# Altium schematic sheet 02_Connectors.SchDoc: Off Board Connectors
size A; Revision: A; SheetNumber: 2; SheetTotal: 4; ECE315_Project_Name: ECE453 F23 Base Project
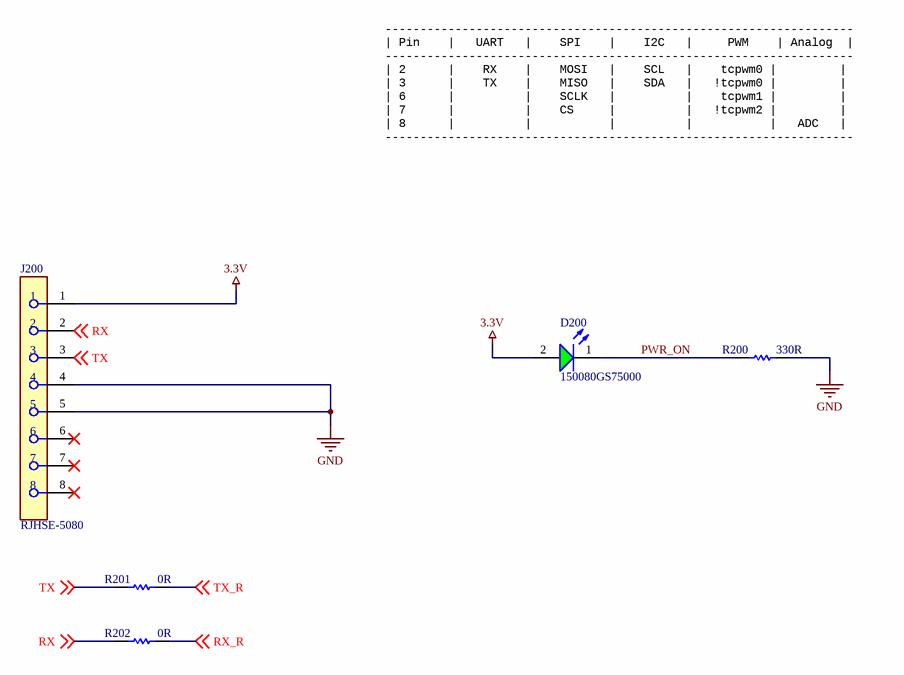
[diagram p0: 02_Connectors.SchDoc]

## Parts
D200  150080GS75000  [WL-SMCW_0805_150080xx75000]
J200  RJHSE-5080  [FP-RJHSE-5080-MFG]
R200  330R  [RESC2013X60X40LL20T25]
R201  0R  [RESC2013X70X40NL20T20]
R202  0R  [RESC2013X70X40NL20T20]

## Nets
3.3V: D200.2(A) J200.1
GND: J200.4 J200.5 R200.2
PWR_ON: D200.1(K) R200.1
RX: J200.2 R202.1 ; off-sheet RX
RX_R: R202.2 ; off-sheet RX_R
TX: J200.3 R201.1 ; off-sheet TX
TX_R: R201.2 ; off-sheet TX_R

Not connected (* = marked no-connect by the designer): J200 6* 7* 8*

## Notes on the sheet
- -------------------------------------------------------------------
  | Pin    |   UART   |    SPI    |    I2C   |     PWM    | Analog  |
  -------------------------------------------------------------------
  | 2      |    RX    |    MOSI   |    SCL   |    tcpwm0 |         |
  | 3      |    TX    |    MISO   |    SDA   |   !tcpwm0 |         |
  | 6      |          |    SCLK   |          |    tcpwm1 |         |
  | 7      |          |    CS     |          |   !tcpwm2 |         |
  | 8      |          |           |          |           |   ADC   |
  -------------------------------------------------------------------
- Title:
- Size:
- A
- Project
- Rev:
- Sheet:
- of
- College of Engineering
- 1415 Engineering Drive
- Madison, WI 53706

## Library data of the parts
D200 = CMP-1426-00007-2: NexarPartId: 29717780; Manufacturer: Wurth Electronics; Wavelength: 520nm; Forward Current: 100mA; Lens Style: Clear, Rectangular; Dominant Wavelength: 525nm; Max Junction Temperature (Tj): 95°C; Power Dissipation: 105mW; Luminous Intensity: 450mcd; Peak Wavelength: 515nm; Color: Green; Viewing Angle: 140°; Test Current: 20mA; Reverse Voltage: 5V; Forward Voltage: 3.2V; Lens Color: Colorless; Lens Transparency: Clear; Lens Size: 1.25mm; Mount: Surface Mount; REACH SVHC: Unknown; Min Operating Temperature: -40°C; Case Code (Imperial): 0805; Case/Package: 0805; Max Operating Temperature: 85°C; RoHS: Compliant; Length: 2mm; Height: 700µm; Width: 1.25mm; Case Code (Metric): 2012; Packaging: Tape and Reel; Max Reverse Voltage (DC): 5V; Supplier: Digikey; Supplier Part Number: 732-4983-1-ND; Manufacturer Part Number: 150080GS75000; Category: LEDs; Stock: 29733; Pricing: 1=0.19, 50=0.176, 100=0.151, 500=0.131 (USD); Mounting Technology: Surface Mount; Package Quantity: 1; Series: WL-SMCW; RoHS Compliant: Yes; Reach SVHC Compliant: Unknown; ComponentLink1URL: https://datasheet.ciiva.com/29563/150080gs75000-29563008.pdf?src-supplier=Digikey; ComponentLink1Description: https://datasheet.ciiva.com/29563/150080gs75000-29563008.pdf?src-supplier=Digikey; ComponentLink2URL: https://datasheet.ciiva.com/29279/759434-da-01-en-chipled-0805-w-kl-gruen-150080gs75000-29279039.pdf?src-supplier=Conrad; ComponentLink2Description: https://datasheet.ciiva.com/29279/759434-da-01-en-chipled-0805-w-kl-gruen-150080gs75000-29279039.pdf?src-supplier=Conrad
J200 = CMP-02366-000003-1: CONN MOD JACK 8P8C R/A UNSHLD; Manufacturer: Amphenol; Current Rating: 1.5A; Voltage Rating: 125V; Pitch: 1.02mm; Conn Orientation: Right Angle; Number Of Contacts: 8; Is Female: yes; Conn Gender: Female; Contact Resistance: 20mR; Number of Ports: 1; Connector Type: RJ45; Lead Free: Yes; Device Class L3: unset; Footprint Url: https://cdn.amphenol-icc.com/media/wysiwyg/files/drawing/rjhse5080.pdf?__cf_chl_jschl_tk__=e349db0bbbb6188a39347cd5e541b92fa02c9719-1587748343-0-AW7tChdeHzRPLX9gSWj7WrKaXQoY9BsmT9Ek0h-T62M9y3Rs9iypFcOtkzb-6sGYQEjFE-jcoNciDETCOZrh1rYyOesac5SvYLoLwHIsHvF4AKBlx-MXmfZUVk9OTTJLqyQq2qMm0PFRLJpNcK0nrKResqOniRSYixG2sPTmOPraH-ULJFBDL602CHqcI9KKBgTq90Jh1OL2Td4moJ99rFsJRJ1Tk_uoxGe8ublcP_ARu-uLpWcQrBcwOcHDTAwL29DAwVaqcH7ta8Ks7WMlHmVl_pILeEDwT0bE9vu5Pa5S3PtNRF1leuFkgi_FMbUxTDulc5xzbXSfng8srUIV1lWXny5nx1fZJEUa_w97yKjffzBMxiWLWVN-V7-uqAaPbyv_m-wRyw5O25OZNyJOeGU; ComponentLink2URL: https://cdn.amphenol-icc.com/media/wysiwyg/files/documentation/datasheet/inputoutput/io-modjack-rjhse.pdf; Device Class L1: Connectors; Package: CONN_MOD_JACK; Mouser Description: Modular Connectors / Ethernet Connectors R/A RJ45 NONSHIELDED 8 CONT NO LEDS; Manufacturer Part Number: RJHSE-5080; Octopart: https://octopart.com/rjhse-5080-amphenol-45060; Category: Conn; Height: 0.535inch; Temperature: -55°C to +85°C; Digikey Description: CONN MOD JACK 8P8C R/A UNSHLD; Device Class L2: Modular / Ethernet Connectors; Contact Material: Gold,Nickel; ComponentLink2Description: Datasheet; Temperature Range Low: -55°C; RoHS: TRUE; Automotive: No; Temperature Range High: +85°C; Supplier: Digikey; Supplier Part Number: RJHSE-5080-ND; Stock: 72112; Pricing: 1=1.03, 10=0.867, 25=0.832, 50=0.8142, 100=0.7788, 250=0.708, 500=0.6372, 1000=0.56641, 2500=0.51331 (USD); Mounting Technology: Through Hole,Panel; Contact Plating: Gold; Max Current Rating: 1.5A; Number of Positions Loaded: 8; Max Voltage Rating (AC): 125V; Orientation: Right Angle; Packaging: Rail/Tube; Gender: Female; Termination: Solder; Number of Positions: 8; Voltage Rating (DC): 125V; Length: 15.75mm; Depth: 14.99mm; Radiation Hardening: No; RoHS Compliant: Yes; Reach SVHC Compliant: Unknown; ComponentLink1URL: https://datasheet.ciiva.com/7629/1682821-7629402.pdf?src-supplier=Element14; ComponentLink1Description: https://datasheet.ciiva.com/7629/1682821-7629402.pdf?src-supplier=Element14; ComponentLink3URL: https://datasheet.ciiva.com/1432/1693748-1432448.pdf?src-supplier=Element14; ComponentLink3Description: https://datasheet.ciiva.com/1432/1693748-1432448.pdf?src-supplier=Element14
R200 = CMP-2001-00628-1: Manufacturer: Panasonic; Part Number: ERA6AEB331V; Manufacturer Part Number: ERA-6AEB331V; Tolerance: 0.1%; Power: 125mW; Rated Temperature: 85°C; Temperature Coefficient: 25ppm/°C; Working Voltage: 100V; Package Height: 0.5mm; Package Length: 2mm; Package Width: 1.25mm; Reference Standard: AEC-Q200; Supplier: Digikey; Supplier Part Number: P330DACT-ND; RoHS: Yes; Category: Chip SMD Resistors; Stock: 18932; Pricing: 1=0.13, 10=0.095, 50=0.0748, 100=0.067, 500=0.05106, 1000=0.04511 (USD); Mounting Technology: Surface Mount; Pins: 2; Case/Package: 0805; Terminal Finish: Nickel; Min Operating Temperature: -55°C; Max Operating Temperature: 155°C; JESD-609 Code: e3; Resistor Type: FIXED RESISTOR; Construction: Rectangular; Package Style: SMTMeter; Packaging: Tape and Reel; Value: 330R; Technology: THIN FILM; Termination: Wraparound; Reach SVHC Compliant: Yes; RoHS Compliant: Yes; ComponentLink1URL: https://datasheet.ciiva.com:443/pdfs/VipMasterIC/IC/PANA/PANA-S-A0009459258/PANA-S-A0009459258-1.pdf?src-supplier=IHS+Markit; ComponentLink1Description: https://datasheet.ciiva.com:443/pdfs/VipMasterIC/IC/PANA/PANA-S-A0009459258/PANA-S-A0009459258-1.pdf?src-supplier=IHS+Markit; ComponentLink2URL: https://datasheet.ciiva.com/11808/0900766b80eb1d8c-11808093.pdf?src-supplier=Rs; ComponentLink2Description: https://datasheet.ciiva.com/11808/0900766b80eb1d8c-11808093.pdf?src-supplier=Rs; ComponentLink3URL: https://datasheet.ciiva.com/29184/452857-da-01-en-widerstand-0805-era-29184079.pdf?src-supplier=Conrad; ComponentLink3Description: https://datasheet.ciiva.com/29184/452857-da-01-en-widerstand-0805-era-29184079.pdf?src-supplier=Conrad; ComponentLink4URL: https://datasheet.ciiva.com/30237/54aoa0000ce26-30237450.pdf?src-supplier=Onlinecomponents.com; ComponentLink4Description: https://datasheet.ciiva.com/30237/54aoa0000ce26-30237450.pdf?src-supplier=Onlinecomponents.com; ComponentLink5URL: https://datasheet.ciiva.com/16777/70068849-16777611.pdf?src-supplier=Allied+Electronics; ComponentLink5Description: https://datasheet.ciiva.com/16777/70068849-16777611.pdf?src-supplier=Allied+Electronics; ComponentLink6URL: https://datasheet.ciiva.com/9182/aoa0000ce26-9182968.pdf?src-supplier=Avnet; ComponentLink6Description: https://datasheet.ciiva.com/9182/aoa0000ce26-9182968.pdf?src-supplier=Avnet; ComponentLink7URL: https://datasheet.ciiva.com/48536/era-eng-tds-48536857.pdf?src-supplier=Distrelec; ComponentLink7Description: https://datasheet.ciiva.com/48536/era-eng-tds-48536857.pdf?src-supplier=Distrelec; ComponentLink8URL: https://datasheet.ciiva.com/22744/1776116-22744153.pdf?src-supplier=Element14; ComponentLink8Description: https://datasheet.ciiva.com/22744/1776116-22744153.pdf?src-supplier=Element14; ComponentLink9URL: https://datasheet.ciiva.com/46436/485442-46436606.pdf?src-supplier=Element14; ComponentLink9Description: https://datasheet.ciiva.com/46436/485442-46436606.pdf?src-supplier=Element14; ComponentLink10URL: https://datasheet.ciiva.com/6138/485442-6138585.pdf?src-supplier=Farnell; ComponentLink10Description: https://datasheet.ciiva.com/6138/485442-6138585.pdf?src-supplier=Farnell; ComponentLink11URL: https://datasheet.ciiva.com/6138/485442-6138589.pdf?src-supplier=Farnell; ComponentLink11Description: https://datasheet.ciiva.com/6138/485442-6138589.pdf?src-supplier=Farnell; ComponentLink12URL: https://datasheet.ciiva.com/22759/485442-22759176.pdf?src-supplier=Farnell; ComponentLink12Description: https://datasheet.ciiva.com/22759/485442-22759176.pdf?src-supplier=Farnell; ComponentLink13URL: https://datasheet.ciiva.com/43457/485442-43457816.pdf?src-supplier=Farnell; ComponentLink13Description: https://datasheet.ciiva.com/43457/485442-43457816.pdf?src-supplier=Farnell; ComponentLink14URL: https://datasheet.ciiva.com/24164/aoa0000ce26-197354-24164407.pdf?src-supplier=Mouser; ComponentLink14Description: https://datasheet.ciiva.com/24164/aoa0000ce26-197354-24164407.pdf?src-supplier=Mouser
R201 R202 = CMP-1665-00002-5: Chip Resistor, 0 Ohm, +/- 1%, 0.125 W, -55 to 155 degC, 0805 (2012 Metric), RoHS, Tape and Reel; PartNumber: ERJ-6GEY0R00V; Manufacturer: Panasonic; Tolerance: 5%; Resistance: 0 Ohm; Power: 125mW; Rated Temperature: 70°C; Package Height: 0.6mm; Package Length: 2mm; Package Width: 1.25mm; Reference Standard: AEC-Q200; REACH SVHC: No SVHC; Min Operating Temperature: -55 degC; Case/Package: 0805; Packaging: Tape and Reel; Package Quantity: 5000; ComponentLink1Description: Manufacturer URL; PackageDescription: 2-Pin Surface Mount Device, Body 2 x 1.25 mm; Mounting Technology: Surface Mount; Max Operating Temperature: 155 degC; Width: 1.25 mm; RoHSCompliant: True; Height: 0.6 mm; ComponentLink1URL: http://www.panasonic.com/; ComponentLink2URL: http://industrial.panasonic.com/cdbs/www-data/pdf/RDA0000/AOA0000C84.pdf; Case Code (Imperial): 0805; DatasheetVersion: 03/2015; Length: 2 mm; Case Code (Metric): 2012; ComponentLink2Description: Datasheet; Radiation Hardening: No; Supplier: Digikey; Supplier Part Number: P0.0ACT-ND; Manufacturer Part Number: ERJ-6GEY0R00V; RoHS: Yes; Category: Chip SMD Resistors; Stock: 179566; Pricing: 1=0.1, 10=0.057, 25=0.0432, 50=0.033, 100=0.0231, 250=0.01856, 500=0.01484, 1000=0.01092 (USD); Pins: 2; Package Shape: Rectangular; Terminal Finish: Nickel; JESD-609 Code: e3; Resistor Type: FIXED RESISTOR; Construction: Rectangular; Package Style: SMTMeter; Value: 0R; Technology: METAL GLAZE/THICK FILM; Termination: Wraparound; Reach SVHC Compliant: Yes; RoHS Compliant: Yes; ComponentLink3URL: https://datasheet.ciiva.com:443/pdfs/VipMasterIC/IC/PANA/PANA-S-A0009459603/PANA-S-A0009459603-1.pdf?src-supplier=IHS+Markit; ComponentLink3Description: https://datasheet.ciiva.com:443/pdfs/VipMasterIC/IC/PANA/PANA-S-A0009459603/PANA-S-A0009459603-1.pdf?src-supplier=IHS+Markit; ComponentLink4URL: https://datasheet.ciiva.com/36526/1989607-36526237.pdf?src-supplier=Jameco; ComponentLink4Description: https://datasheet.ciiva.com/36526/1989607-36526237.pdf?src-supplier=Jameco; ComponentLink5URL: https://datasheet.ciiva.com/11821/0900766b80f806dd-11821735.pdf?src-supplier=Rs; ComponentLink5Description: https://datasheet.ciiva.com/11821/0900766b80f806dd-11821735.pdf?src-supplier=Rs; ComponentLink6URL: https://datasheet.ciiva.com/43460/1678796-43460073.pdf?src-supplier=Farnell; ComponentLink6Description: https://datasheet.ciiva.com/43460/1678796-43460073.pdf?src-supplier=Farnell; ComponentLink7URL: https://datasheet.ciiva.com/46377/1678796-46377866.pdf?src-supplier=Element14; ComponentLink7Description: https://datasheet.ciiva.com/46377/1678796-46377866.pdf?src-supplier=Element14; ComponentLink8URL: https://datasheet.ciiva.com/28695/1678796-28695877.pdf?src-supplier=Element14; ComponentLink8Description: https://datasheet.ciiva.com/28695/1678796-28695877.pdf?src-supplier=Element14; ComponentLink9URL: https://datasheet.ciiva.com/9117/aoa0000ce1-9117354.pdf?src-supplier=Avnet; ComponentLink9Description: https://datasheet.ciiva.com/9117/aoa0000ce1-9117354.pdf?src-supplier=Avnet